# Altium project GateWay.PrjPCB
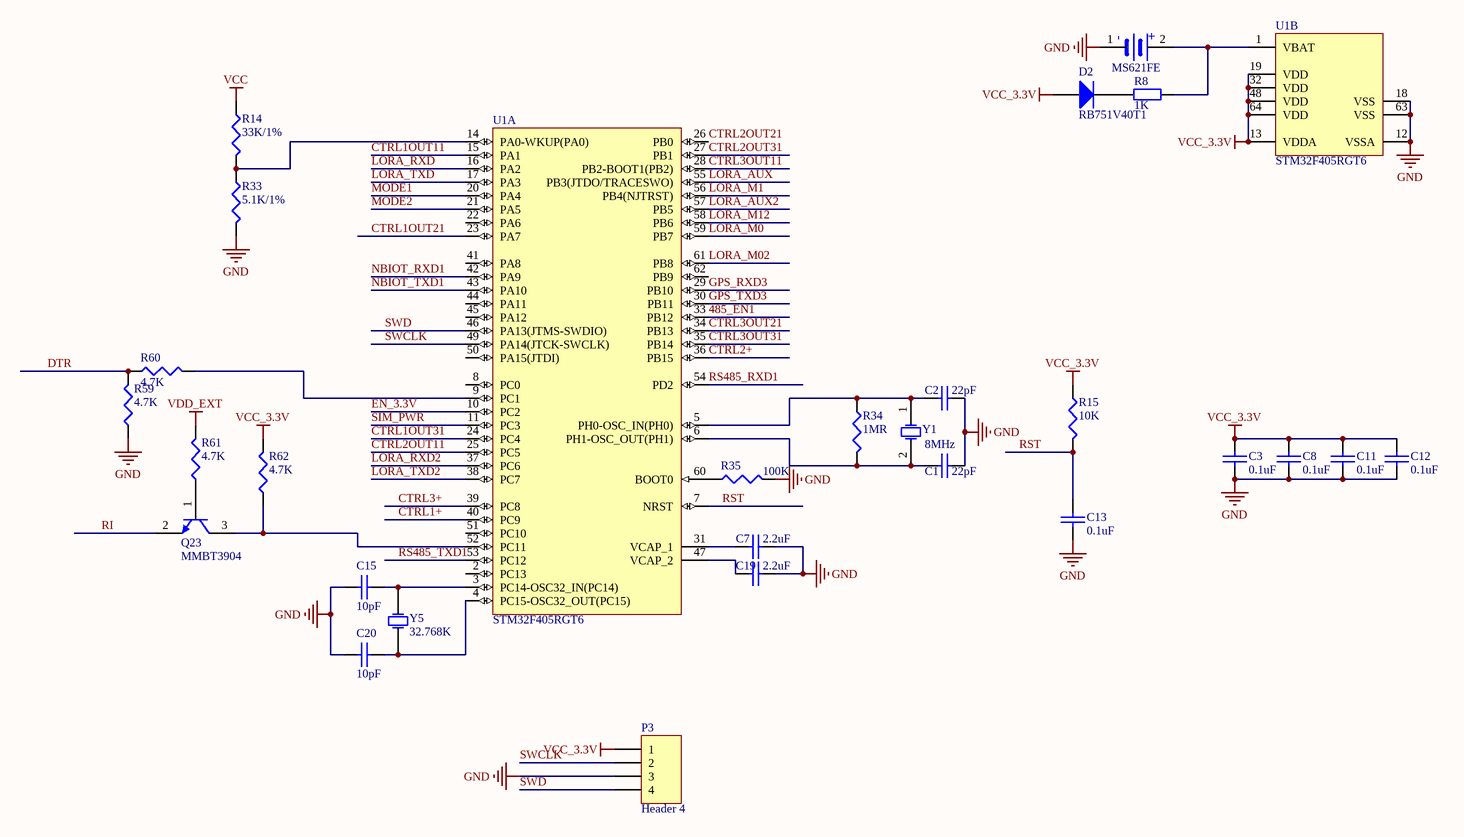
[diagram p0: CPU.SchDoc]
6 sheets, 164 parts. Net scope: global (net labels, ports and power ports of the same name join across sheets).
Board file: GateWay.PcbDoc
Sheets:
  CPU.SchDoc
  LORA.SchDoc
  nbiot&gps.SchDoc
  POWER.SchDoc
  CONNECTOR.SchDoc
  rs485.SchDoc

## Sheet CPU.SchDoc
size A3

### Parts
C1  22pF  [0603c]
C2  22pF  [0603c]
C3  0.1uF  [0603c]
C7  2.2uF  [0603c]
C8  0.1uF  [0603c]
C11  0.1uF  [0603c]
C12  0.1uF  [0603c]
C13  0.1uF  [0603c]
C15  10pF  [0603c]
C19  2.2uF  [0603c]
C20  10pF  [0603c]
D2  RB751V40T1  [SOD323]
MS621FE  SBatery  [MS621FE]  (value not drawn)
P3  Header 4  [HDR1X4]
Q23  MMBT3904  [SOT23-3]
R8  1K  [0603R]
R14  33K/1%  [0603R]
R15  10K  [0603R]
R33  5.1K/1%  [0603R]
R34  1MR  [0603R]
R35  100K  [0603R]
R59  4.7K  [0603R]
R60  4.7K  [0603R]
R61  4.7K  [0603R]
R62  4.7K  [0603R]
U1  STM32F405RGT6  [LQFP-64]  (parts A,B of 2)
Y1  8MHz  [CRAY_5032]
Y5  32.768K  [32.768K]

### Nets
GND: C1.1 C2.1 C3.1 C7.1 C8.1 C11.1 C12.1 C13.1 C15.1 C19.1 C20.1 MS621FE.1 P3.3 R33.2 R35.2 R59.1 U1.12(VSSA) U1.18(VSS) U1.63(VSS)  [project net AGND]
VCC: R14.1
VCC_3.3V: C3.2 C8.2 C11.2 C12.2 D2.1(A) P3.1 R15.1 R62.2 U1.13(VDDA) U1.19(VDD) U1.32(VDD) U1.48(VDD) U1.64(VDD)
VDD_EXT: R61.2
485_EN1: U1.33(PB12)
CTRL1+: U1.40(PC9)
CTRL1OUT11: U1.15(PA1)
CTRL1OUT21: U1.23(PA7)
CTRL1OUT31: U1.24(PC4)
CTRL2+: U1.36(PB15)
CTRL2OUT11: U1.25(PC5)
CTRL2OUT21: U1.26(PB0)
CTRL2OUT31: U1.27(PB1)
CTRL3+: U1.39(PC8)
CTRL3OUT11: U1.28(PB2-BOOT1(PB2))
CTRL3OUT21: U1.34(PB13)
CTRL3OUT31: U1.35(PB14)
DTR: R59.2 R60.1
EN_3.3V: U1.10(PC2)
GPS_RXD3: U1.29(PB10)
GPS_TXD3: U1.30(PB11)
LORA_AUX: U1.55(PB3(JTDO/TRACESWO))
LORA_AUX2: U1.57(PB5)
LORA_M0: U1.59(PB7)
LORA_M1: U1.56(PB4(NJTRST))
LORA_M02: U1.61(PB8)
LORA_M12: U1.58(PB6)
LORA_RXD: U1.16(PA2)
LORA_RXD2: U1.37(PC6)
LORA_TXD: U1.17(PA3)
LORA_TXD2: U1.38(PC7)
MODE1: U1.20(PA4)
MODE2: U1.21(PA5)
NBIOT_RXD1: U1.42(PA9)
NBIOT_TXD1: U1.43(PA10)
RI: Q23.2(E)
RS485_RXD1: U1.54(PD2)
RS485_TXD1: U1.53(PC12)
RST: C13.2 R15.2 U1.7(NRST)
SIM_PWR: U1.11(PC3)
SWCLK: P3.2 U1.49(PA14(JTCK-SWCLK))
SWD: P3.4 U1.46(PA13(JTMS-SWDIO))
NetC1_2: C1.2 R34.2 U1.6(PH1-OSC_OUT(PH1)) Y1.2(OSC2)
NetC2_2: C2.2 R34.1 U1.5(PH0-OSC_IN(PH0)) Y1.1(OSC1)
NetC7_2: C7.2 U1.31(VCAP_1)
NetC15_2: C15.2 U1.3(PC14-OSC32_IN(PC14)) Y5.1(OSC1)
NetC19_2: C19.2 U1.47(VCAP_2)
NetC20_2: C20.2 U1.4(PC15-OSC32_OUT(PC15)) Y5.2(OSC2)
NetD2_2: D2.2(K) R8.1
NetMS621FE_2: MS621FE.2 R8.2 U1.1(VBAT)
NetQ23_1: Q23.1(B) R61.1
NetQ23_3: Q23.3(C) R62.1 U1.52(PC11)
NetR14_2: R14.2 R33.1 U1.14(PA0-WKUP(PA0))
NetR35_1: R35.1 U1.60(BOOT0)
NetR60_2: R60.2 U1.9(PC1)

Not connected (* = marked no-connect by the designer): U1 2(PC13) 8(PC0) 22(PA6) 41(PA8) 44(PA11) 45(PA12) 50(PA15(JTDI)) 51(PC10) 62(PB9)

### Notes on the sheet
- (in symbol SBatery) -; +

### Library data of the parts
C1-C3 C7 C8 C11-C13 C15 C19 C20 = CAP: Capacitor
D2 = Diode: Default Diode; Published: 8-Jun-2000; LatestRevisionDate: 17-Jul-2002; LatestRevisionNote: Re-released for DXP Platform.; PackageDocument: Sep-1996; PackageReference: SMC; Publisher: Altium Limited; Code_JEDEC: DO-214-AB
P3 = Header 4: Header, 4-Pin; LatestRevisionDate: 17-Jul-2002; LatestRevisionNote: Re-released for DXP Platform.; Publisher: Altium Limited
Q23 = NPN
R8 = Res2: Resistor; Published: 8-Jun-2000; LatestRevisionDate: 17-Jul-2002; LatestRevisionNote: Re-released for DXP Platform.; PackageReference: AXIAL-0.4; Publisher: Altium Limited; Value: 1K
R14 R15 R33-R35 = Res3: Resistor; Published: 8-Jun-2000; LatestRevisionDate: 29-May-2009; LatestRevisionNote: IPC-7351 Footprint Added.; PackageReference: J1-0603; Publisher: Altium Limited; PackageDescription: Chip Resistor
R59-R62 = RES1: P: 1/8W
U1 = STM32F405RGT6: ARM Cortex-M4 32-bit MCU+FPU, 210 DMIPS, 1024 kB Flash, 192 kB Internal RAM, 51 I/Os, 64-pin LQFP, -40 to 85 degC, Tray; Manufacturer: STMicroelectronics; D/A Converter: 2x12-bit; FLASH Size (Prog) (kB): 1024; I/Os (High Current): 51; Internal RAM Size (kB): 192; Operating Frequency(F) (Processor speed) (MHz): 168; Supply Voltage(Vcc) max (V): 3.6; Supply Voltage(Vcc) min (V): 1.8; DatasheetVersion: Rev. 4; PackageVersion: Rev. 4, 06/2013; PackageReference: LQFP64; PackageDescription: 64-Pin Low Profile Quad Flat Package, 10 x 10 mm Body, 0.5 mm Pitch; Supplier 1: Digi-Key; Supplier Part Number 1: 497-11767-ND; Supplier 2: Farnell; Supplier Part Number 2: 2064363; Supplier 3: Newark; Supplier Part Number 3: 73T2329; Supplier 4: Mouser; Supplier Part Number 4: 511-STM32F405RGT6; Core: ARM Cortex-M4; Packing: Tray; Mounting Technology: Surface Mount; PartNumber: STM32F405RGT6; ComponentLink1Description: Manufacturer URL; ComponentLink1URL: http://www.st.com/web/en/home.html; ComponentLink2Description: Datasheet; ComponentLink2URL: http://www.st.com/st-web-ui/static/active/en/resource/technical/document/datasheet/DM00037051.pdf; ComponentLink3Description: Package Specification; ComponentLink3URL: http://www.st.com/st-web-ui/static/active/en/resource/technical/document/datasheet/DM00037051.pdf
Y1 Y5 = XTAL: Crystal Oscillator; Published: 8-Jun-2000; LatestRevisionDate: 17-Jul-2002; LatestRevisionNote: Re-released for DXP Platform.; PackageReference: R38; Publisher: Altium Limited
  Y1: PackageDescription: Crystal, Thru-Hole; 2 Leads; Body 3.1 x 8.2 mm (Dia.xH)

## Sheet LORA.SchDoc
size A4
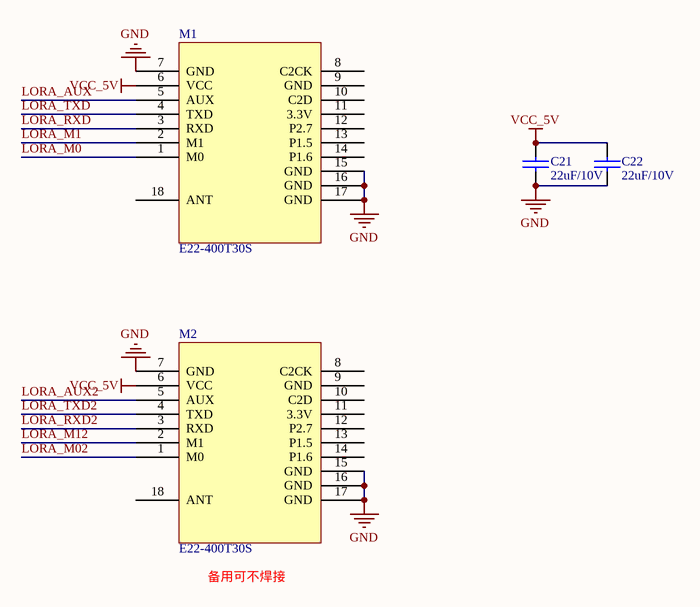
[diagram p1: LORA.SchDoc]

### Parts
C21  22uF/10V  [1206C]
C22  22uF/10V  [1206C]
M1  E22-400T30S  [E22-400T30S]
M2  E22-400T30S  [E22-400T30S]

### Nets
GND: C21.2 C22.2 M1.7(GND) M1.15(GND) M1.16(GND) M1.17(GND) M2.7(GND) M2.15(GND) M2.16(GND) M2.17(GND)  [project net AGND]
VCC_5V: C21.1 C22.1 M1.6(VCC) M2.6(VCC)  [project net VCC5V_OUT]
LORA_AUX: M1.5(AUX)
LORA_AUX2: M2.5(AUX)
LORA_M0: M1.1(M0)
LORA_M1: M1.2(M1)
LORA_M02: M2.1(M0)
LORA_M12: M2.2(M1)
LORA_RXD: M1.3(RXD)
LORA_RXD2: M2.3(RXD)
LORA_TXD: M1.4(TXD)
LORA_TXD2: M2.4(TXD)

Not connected (* = marked no-connect by the designer): M1 8(C2CK) 9(GND) 10(C2D) 11(3.3V) 12(P2.7) 13(P1.5) 14(P1.6) 18(ANT); M2 8(C2CK) 9(GND) 10(C2D) 11(3.3V) 12(P2.7) 13(P1.5) 14(P1.6) 18(ANT)

### Notes on the sheet
- 备用可不焊接

### Library data of the parts
C21 C22 = CAP: Capacitor

## Sheet nbiot&gps.SchDoc
size A3
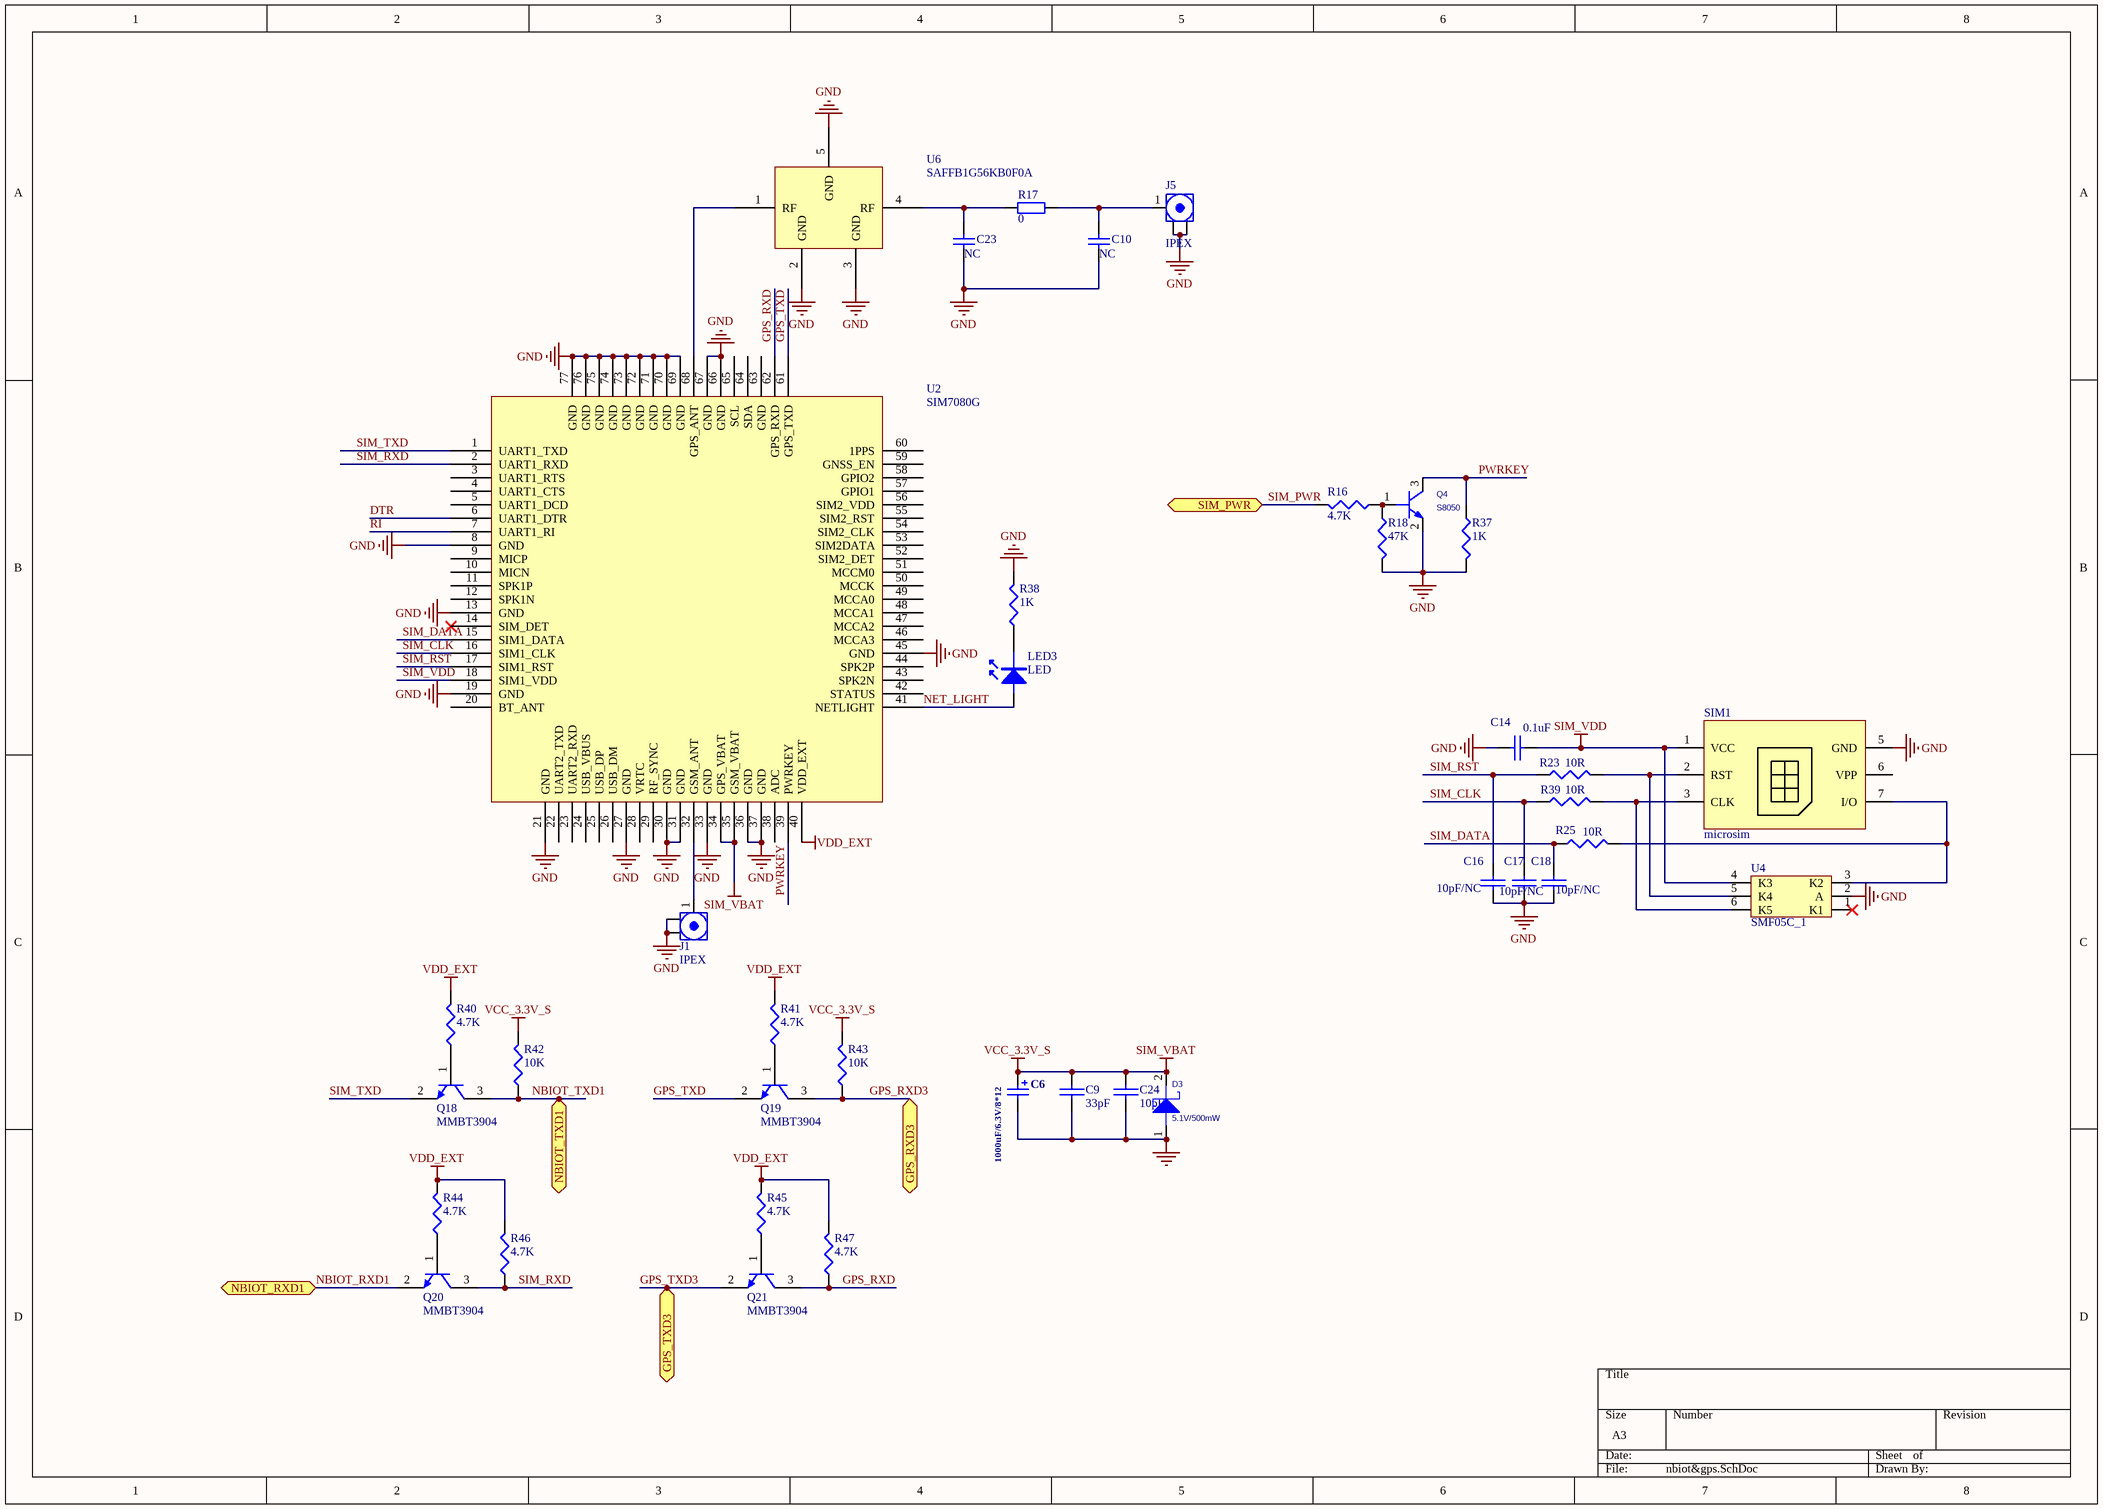
[diagram p2: nbiot&gps.SchDoc]

### Parts
C6  1000uF/6.3V/8*12  [8*12]
C9  33pF  [0603C]
C10  NC  [0603C]
C14  0.1uF  [0603C]
C16  10pF/NC  [0603C]
C17  10pF/NC  [0603C]
C18  10pF/NC  [0603C]
C23  NC  [0603C]
C24  10pF  [0603C]
D3  value 5.1V/500mW  [LL-34(D1206)]  (hidden comment: DIODE_SCHOTTKY_0)
J1  IPEX  [RF-UFL]
J5  IPEX  [RF-UFL]
LED3  LED  [0603LED]
Q4  S8050  [SOT23]
Q18  MMBT3904  [SOT23-3]
Q19  MMBT3904  [SOT23-3]
Q20  MMBT3904  [SOT23-3]
Q21  MMBT3904  [SOT23-3]
R16  4.7K  [0603R]
R17  0  [0603R]
R18  47K  [0603R]
R23  10R  [0603R]
R25  10R  [0603R]
R37  1K  [0603R]
R38  1K  [0603R]
R39  10R  [0603R]
R40  4.7K  [0603R]
R41  4.7K  [0603R]
R42  10K  [0603R]
R43  10K  [0603R]
R44  4.7K  [0603R]
R45  4.7K  [0603R]
R46  4.7K  [0603R]
R47  4.7K  [0603R]
SIM1  microsim  [Nano SIM]
U2  SIM7080G  [SIM868]
U4  SMF05C_1  [SC70-6L]
U6  SAFFB1G56KB0F0A  [SAFFB1G56KB0F0A]

### Ports
GPS_RXD3, GPS_TXD3, NBIOT_RXD1, NBIOT_TXD1, SIM_PWR

### Nets
GND: C6.2 C9.1 C10.2 C14.1 C16.1 C17.1 C18.1 C23.2 C24.1 D3.1 J1.2(Y) J5.2(Y) Q4.2(E) R18.2 R37.2 R38.2 SIM1.5(GND) U2.8(GND) U2.13(GND) U2.19(GND) U2.21(GND) U2.27(GND) U2.30(GND) U2.31(GND) U2.33(GND) U2.36(GND) U2.37(GND) U2.45(GND) U2.66(GND) U2.67(GND) U2.69(GND) U2.70(GND) U2.71(GND) U2.72(GND) U2.73(GND) U2.74(GND) U2.75(GND) U2.76(GND) U2.77(GND) U4.2(A) U6.2(GND) U6.3(GND) U6.5(GND)  [project net AGND]
SIM_VBAT: C6.1 C9.2 C24.2 D3.2 R42.2 R43.2 U2.34(GPS_VBAT) U2.35(GSM_VBAT)  [also labelled VCC_3.3V_S]
SIM_VDD: C14.2 SIM1.1(VCC) U2.18(SIM1_VDD) U4.4(K3)
VDD_EXT: R40.2 R41.2 R44.2 R45.2 R46.2 R47.2 U2.40(VDD_EXT)
DTR: U2.6(UART1_DTR)
GPS_RXD: Q21.3(C) R47.1 U2.62(GPS_RXD)
GPS_RXD3: Q19.3(C) R43.1 ; port GPS_RXD3
GPS_TXD: Q19.2(E) U2.61(GPS_TXD)
GPS_TXD3: Q21.2(E) ; port GPS_TXD3
NBIOT_RXD1: Q20.2(E) ; port NBIOT_RXD1
NBIOT_TXD1: Q18.3(C) R42.1 ; port NBIOT_TXD1
NET_LIGHT: LED3.1 U2.41(NETLIGHT)
PWRKEY: Q4.3(C) R37.1 U2.39(PWRKEY)
RI: U2.7(UART1_RI)
SIM_CLK: C17.2 R39.1 U2.16(SIM1_CLK)
SIM_DATA: C18.2 R25.1 U2.15(SIM1_DATA)
SIM_PWR: R16.2 ; port SIM_PWR
SIM_RST: C16.2 R23.1 U2.17(SIM1_RST)
SIM_RXD: Q20.3(C) R46.1 U2.2(UART1_RXD)
SIM_TXD: Q18.2(E) U2.1(UART1_TXD)
NetC10_1: C10.1 J5.1(X) R17.2
NetC23_1: C23.1 R17.1 U6.4(RF)
NetJ1_1: J1.1(X) U2.32(GSM_ANT)
NetLED3_2: LED3.2 R38.1
NetQ4_1: Q4.1(B) R16.1 R18.1
NetQ18_1: Q18.1(B) R40.1
NetQ19_1: Q19.1(B) R41.1
NetQ20_1: Q20.1(B) R44.1
NetQ21_1: Q21.1(B) R45.1
NetR23_2: R23.2 SIM1.2(RST) U4.5(K4)
NetR25_2: R25.2 SIM1.7(I/O) U4.3(K2)
NetR39_2: R39.2 SIM1.3(CLK) U4.6(K5)
NetU2_68: U2.68(GPS_ANT) U6.1(RF)

Not connected (* = marked no-connect by the designer): SIM1 6(VPP); U2 3(UART1_RTS) 4(UART1_CTS) 5(UART1_DCD) 9(MICP) 10(MICN) 11(SPK1P) 12(SPK1N) 14(SIM_DET)* 20(BT_ANT) 22(UART2_TXD) 23(UART2_RXD) 24(USB_VBUS) 25(USB_DP) 26(USB_DM) 28(VRTC) 29(RF_SYNC) 38(ADC) 42(STATUS) 43(SPK2N) 44(SPK2P) 46(MCCA3) 47(MCCA2) 48(MCCA1) 49(MCCA0) 50(MCCK) 51(MCCM0) 52(SIM2_DET) 53(SIM2DATA) 54(SIM2_CLK) 55(SIM2_RST) 56(SIM2_VDD) 57(GPIO1) 58(GPIO2) 59(GNSS_EN) 60(1PPS) 63(GND) 64(SDA) 65(SCL); U4 1(K1)*

### Library data of the parts
C6 = Cap Pol3: Polarized Capacitor (Surface Mount); PackageReference: C10*10.2
C9 C14 C16-C18 C24 = CAP: Capacitor
C10 C23 = Cap: Capacitor; Value: 0.1uF/10V; Published: 8-Jun-2000; LatestRevisionDate: 17-Jul-2002; LatestRevisionNote: Re-released for DXP Platform.; PackageReference: RAD-0.3; Publisher: Altium Limited
D3 = DIODE_SCHOTTKY_0: PCB DECAL: DO_214AC; Source_Path: E:\AIH\WORK\A\LIBRARY1.OLB
J1 J5 = ANT
Q4 = 2N1069_1: PspiceTemplate: Q^@REFDES %C %B %E
Q18-Q21 = NPN
R16 R18 R23 R25 R37-R47 = RES1: P: 1/8W
R17 = Res2: Resistor; Published: 8-Jun-2000; LatestRevisionDate: 17-Jul-2002; LatestRevisionNote: Re-released for DXP Platform.; PackageReference: AXIAL-0.4; Publisher: Altium Limited; Value: 0
U2 = SIM868E/SIM868
U4 = SMF05C_1: TVS
U6 = SAFFB1G56KBOFA

## Sheet POWER.SchDoc
size A3
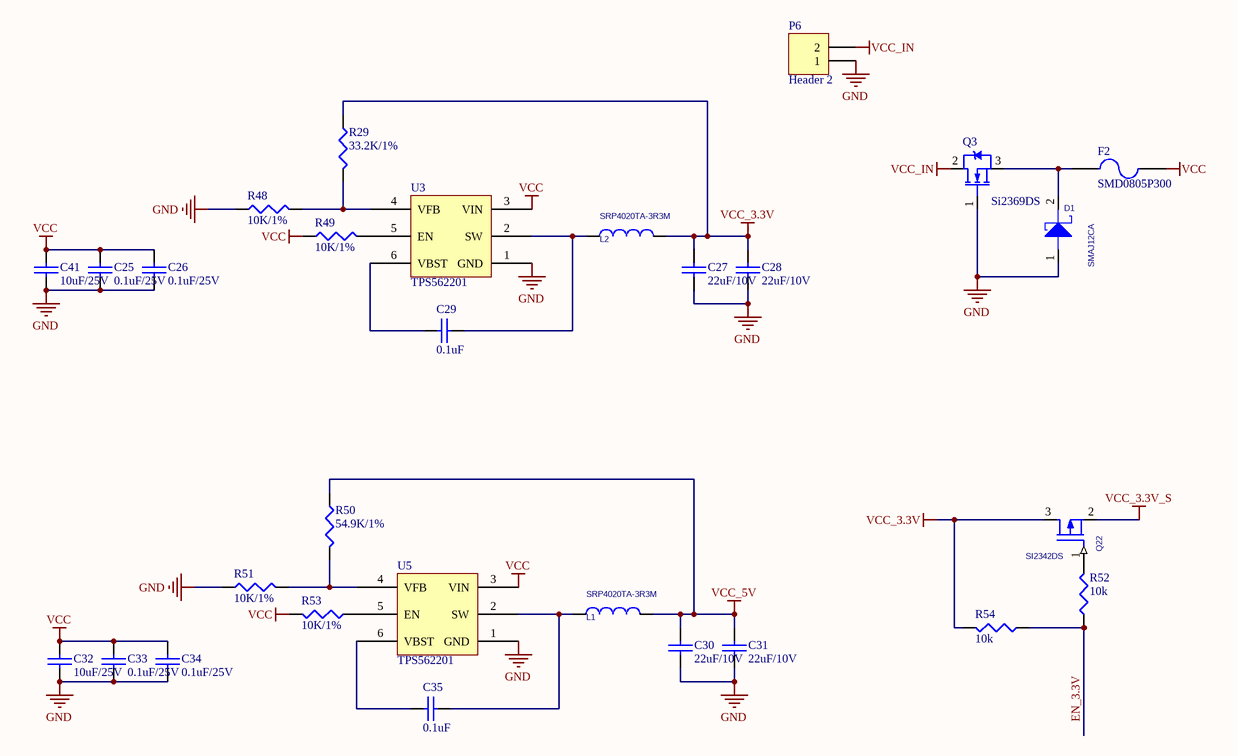
[diagram p3: POWER.SchDoc]

### Parts
C25  0.1uF/25V  [0603C]
C26  0.1uF/25V  [0603C]
C27  22uF/10V  [1206C]
C28  22uF/10V  [1206C]
C29  0.1uF  [0603C]
C30  22uF/10V  [1206C]
C31  22uF/10V  [1206C]
C32  10uF/25V  [0603C]
C33  0.1uF/25V  [0603C]
C34  0.1uF/25V  [0603C]
C35  0.1uF  [0603C]
C41  10uF/25V  [0603C]
D1  SMAJ12CA  [SMA]
F2  SMD0805P300  [0805R]
L1  SRP4020TA-3R3M  [CD_4*4]
L2  SRP4020TA-3R3M  [CD_4*4]
P6  Header 2  [2X2.54MMZ]
Q3  Si2369DS  [sot23-3]
Q22  SI2342DS  [SOT23]
R29  33.2K/1%  [0603R]
R48  10K/1%  [0603R]
R49  10K/1%  [0603R]
R50  54.9K/1%  [0603R]
R51  10K/1%  [0603R]
R52  10k  [0603R]
R53  10K/1%  [0603R]
R54  10k  [0603R]
U3  TPS562201  [SOT-23-6]
U5  TPS562201  [SOT-23-6]

### Nets
GND: C25.1 C26.1 C27.2 C28.2 C30.2 C31.2 C32.1 C33.1 C34.1 C41.1 D1.1 P6.1 Q3.1(G) R48.1 R51.1 U3.1(GND) U5.1(GND)  [project net AGND]
VCC: C25.2 C26.2 C32.2 C33.2 C34.2 C41.2 F2.2 R49.1 R53.2 U3.3(VIN) U5.3(VIN)
VCC_3.3V: C27.1 C28.1 L2.2 Q22.3(SOURCE) R29.1 R54.2
VCC_3.3V_S: Q22.2(DRAIN)  [project net SIM_VBAT]
VCC_5V: C30.1 C31.1 L1.2 R50.1  [project net VCC5V_OUT]
VCC_IN: P6.2 Q3.2(D)
EN_3.3V: R52.1 R54.1
NetC29_1: C29.1 L2.1 U3.2(SW)
NetC29_2: C29.2 U3.6(VBST)
NetC35_1: C35.1 L1.1 U5.2(SW)
NetC35_2: C35.2 U5.6(VBST)
NetD1_2: D1.2 F2.1 Q3.3(S)
NetQ22_1: Q22.1(GATE) R52.2
NetR29_2: R29.2 R48.2 U3.4(VFB)
NetR49_2: R49.2 U3.5(EN)
NetR50_2: R50.2 R51.2 U5.4(VFB)
NetR53_1: R53.1 U5.5(EN)

### Library data of the parts
C25-C35 C41 = CAP: Capacitor
D1 = DIODE_SCHOTTKY_0: as D3 on sheet nbiot&gps; Value: SMAJ12CA
F2 = Fuse 2: Fuse; Published: 8-Jun-2000; LatestRevisionDate: 17-Jul-2002; LatestRevisionNote: Re-released for DXP Platform.; PackageReference: PIN-W2/E2.8; Publisher: Altium Limited
L1 L2 = INDUCTOR_1
P6 = Header 2: Header, 2-Pin; LatestRevisionDate: 17-Jul-2002; LatestRevisionNote: Re-released for DXP Platform.; Publisher: Altium Limited
Q3 = NCE4060K: NMOSFET
Q22 = MOSFET P_1: Color: RGB(255,  0,  0)
R29 R48-R54 = RES1: P: 1/8W

## Sheet CONNECTOR.SchDoc
size A3
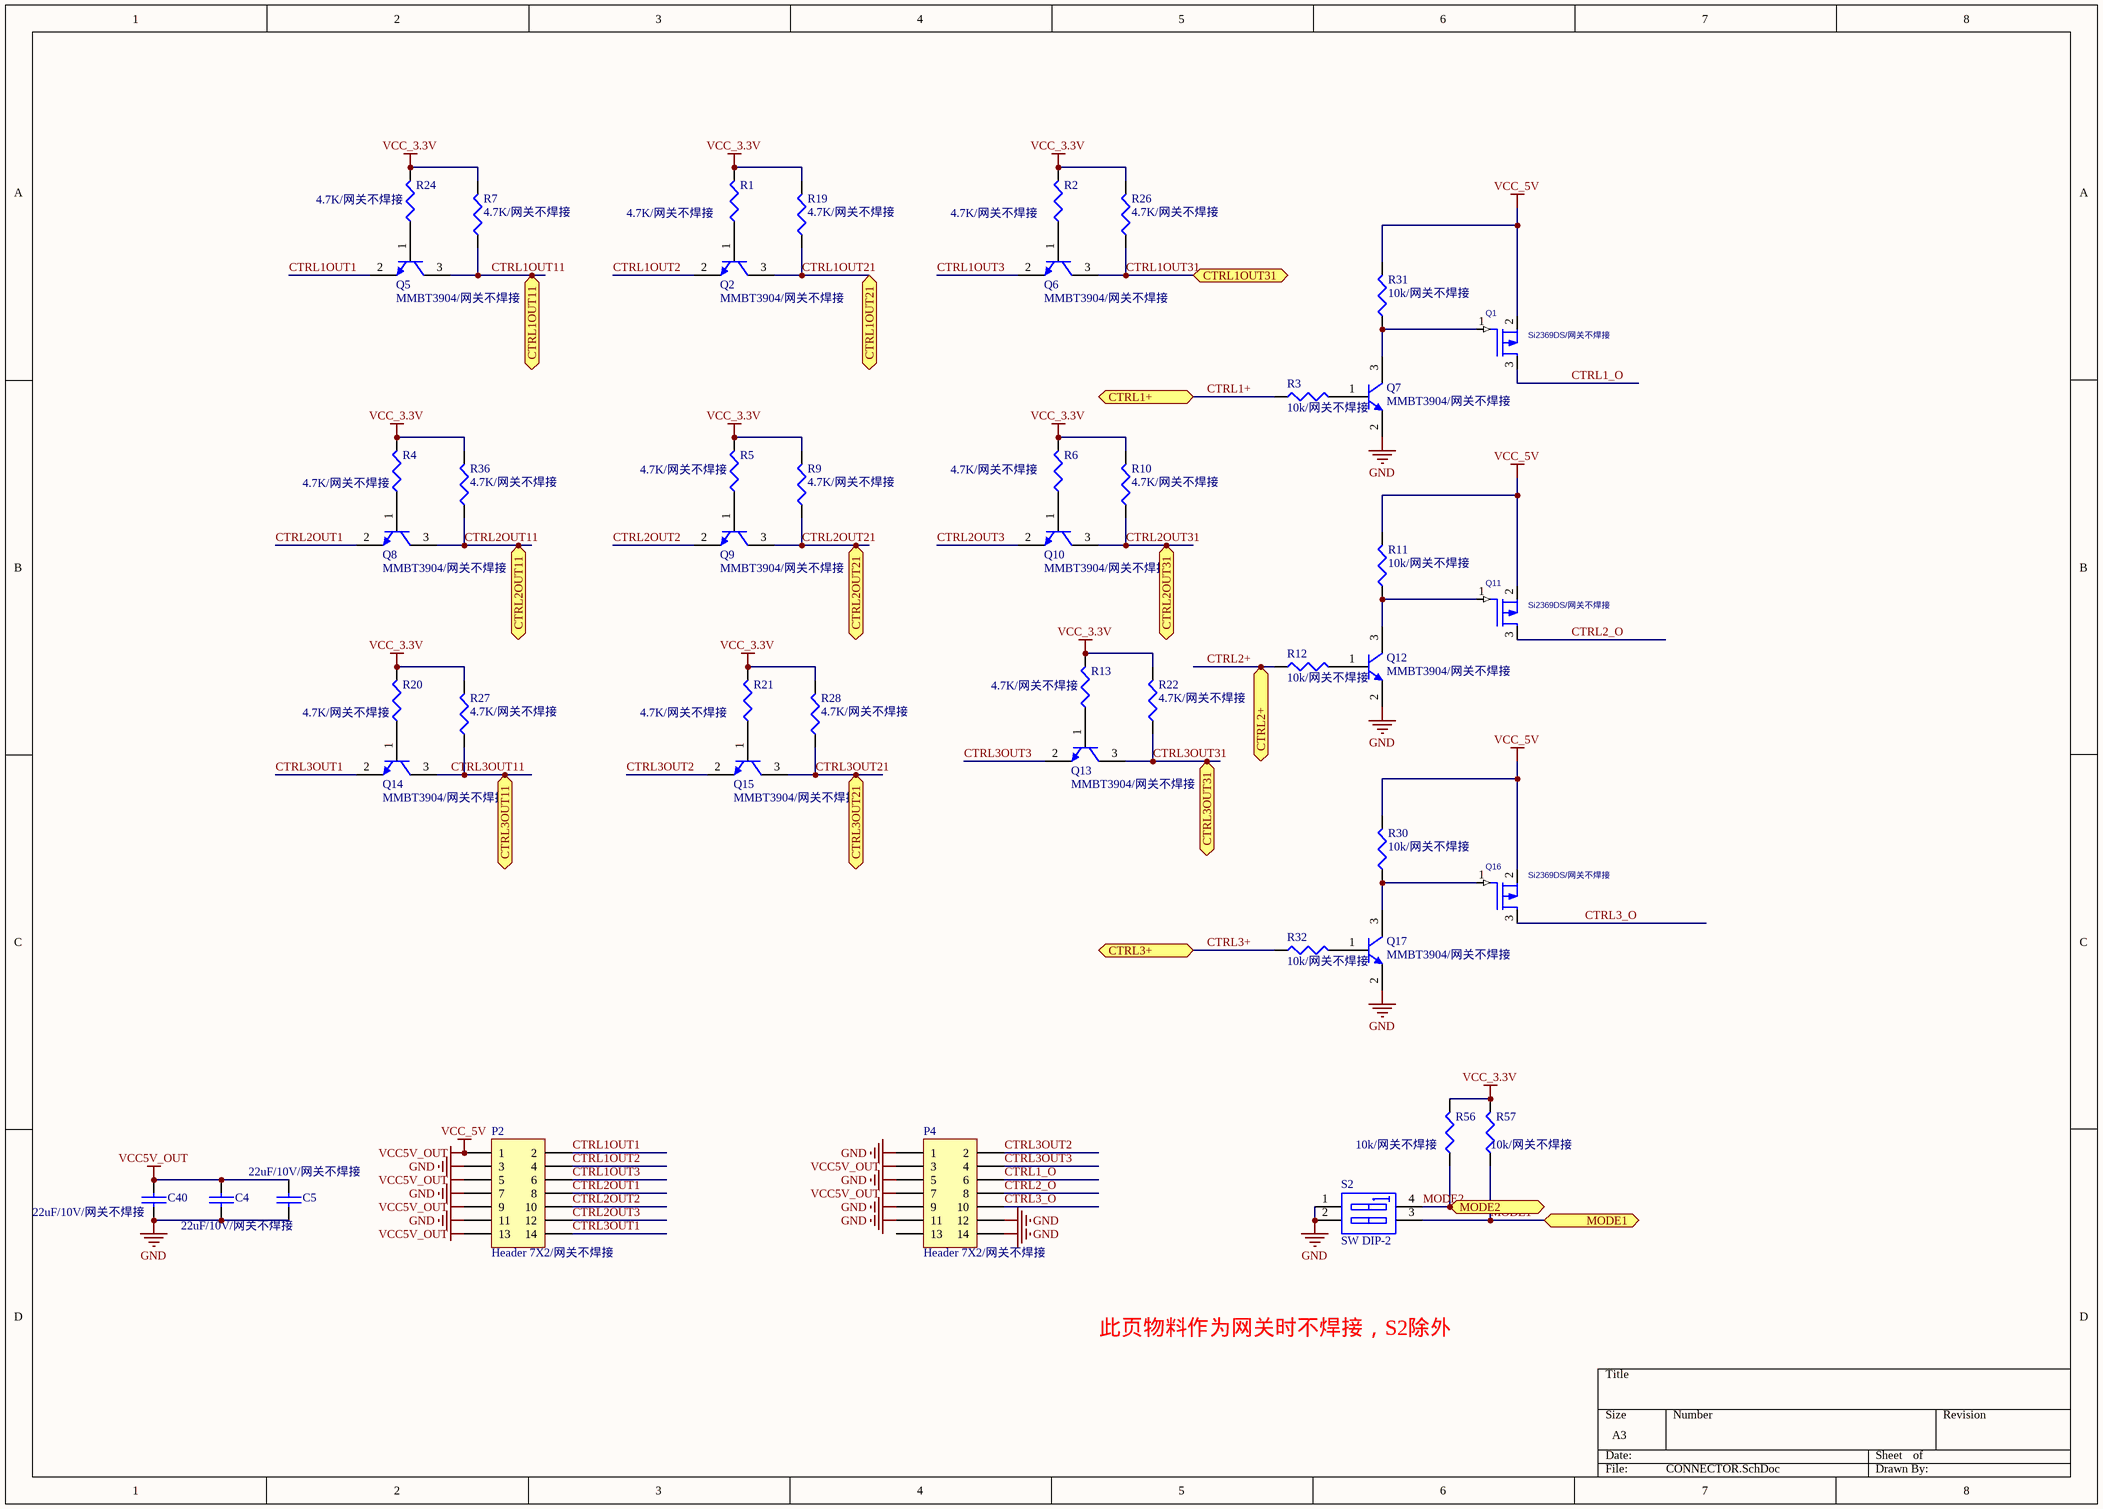
[diagram p4: CONNECTOR.SchDoc]

### Parts
C4  22uF/10V/网关不焊接  [1206C]
C5  22uF/10V/网关不焊接  [1206C]
C40  22uF/10V/网关不焊接  [1206C]
P2  Header 7X2/网关不焊接  [14X2.54MMZ]
P4  Header 7X2/网关不焊接  [14X2.54MMZ]
Q1  Si2369DS/网关不焊接  [SOT23]
Q2  MMBT3904/网关不焊接  [SOT23-3]
Q5  MMBT3904/网关不焊接  [SOT23-3]
Q6  MMBT3904/网关不焊接  [SOT23-3]
Q7  MMBT3904/网关不焊接  [SOT23-3]
Q8  MMBT3904/网关不焊接  [SOT23-3]
Q9  MMBT3904/网关不焊接  [SOT23-3]
Q10  MMBT3904/网关不焊接  [SOT23-3]
Q11  Si2369DS/网关不焊接  [SOT23]
Q12  MMBT3904/网关不焊接  [SOT23-3]
Q13  MMBT3904/网关不焊接  [SOT23-3]
Q14  MMBT3904/网关不焊接  [SOT23-3]
Q15  MMBT3904/网关不焊接  [SOT23-3]
Q16  Si2369DS/网关不焊接  [SOT23]
Q17  MMBT3904/网关不焊接  [SOT23-3]
R1  4.7K/网关不焊接  [0603R]
R2  4.7K/网关不焊接  [0603R]
R3  10k/网关不焊接  [0603R]
R4  4.7K/网关不焊接  [0603R]
R5  4.7K/网关不焊接  [0603R]
R6  4.7K/网关不焊接  [0603R]
R7  4.7K/网关不焊接  [0603R]
R9  4.7K/网关不焊接  [0603R]
R10  4.7K/网关不焊接  [0603R]
R11  10k/网关不焊接  [0603R]
R12  10k/网关不焊接  [0603R]
R13  4.7K/网关不焊接  [0603R]
R19  4.7K/网关不焊接  [0603R]
R20  4.7K/网关不焊接  [0603R]
R21  4.7K/网关不焊接  [0603R]
R22  4.7K/网关不焊接  [0603R]
R24  4.7K/网关不焊接  [0603R]
R26  4.7K/网关不焊接  [0603R]
R27  4.7K/网关不焊接  [0603R]
R28  4.7K/网关不焊接  [0603R]
R30  10k/网关不焊接  [0603R]
R31  10k/网关不焊接  [0603R]
R32  10k/网关不焊接  [0603R]
R36  4.7K/网关不焊接  [0603R]
R56  10k/网关不焊接  [0603R]
R57  10k/网关不焊接  [0603R]
S2  SW DIP-2  [SW_SMT_4]

### Ports
CTRL1+, CTRL1OUT11, CTRL1OUT21, CTRL1OUT31, CTRL2+, CTRL2OUT11, CTRL2OUT21, CTRL2OUT31, CTRL3+, CTRL3OUT11, CTRL3OUT21, CTRL3OUT31, MODE1, MODE2

### Nets
GND: C4.2 C5.2 C40.2 P2.3 P2.7 P2.11 P4.1 P4.5 P4.9 P4.11 P4.12 P4.14 Q7.2(E) Q12.2(E) Q17.2(E) S2.1(A1) S2.2(A2)  [project net AGND]
VCC5V_OUT: C4.1 C5.1 C40.1 P2.1 P2.5 P2.9 P2.13 P4.3 P4.7 Q1.2(DRAIN) Q11.2(DRAIN) Q16.2(DRAIN) R11.2 R30.2 R31.2  [also labelled VCC_5V]
VCC_3.3V: R1.2 R2.2 R4.2 R5.2 R6.2 R7.2 R9.2 R10.2 R13.2 R19.2 R20.2 R21.2 R22.2 R24.2 R26.2 R27.2 R28.2 R36.2 R56.2 R57.2
CTRL1+: R3.1 ; port CTRL1+
CTRL1_O: P4.6 Q1.3(SOURCE)
CTRL1OUT1: P2.2 Q5.2(E)
CTRL1OUT2: P2.4 Q2.2(E)
CTRL1OUT3: P2.6 Q6.2(E)
CTRL1OUT11: Q5.3(C) R7.1 ; port CTRL1OUT11
CTRL1OUT21: Q2.3(C) R19.1 ; port CTRL1OUT21
CTRL1OUT31: Q6.3(C) R26.1 ; port CTRL1OUT31
CTRL2+: R12.1 ; port CTRL2+
CTRL2_O: P4.8 Q11.3(SOURCE)
CTRL2OUT1: P2.8 Q8.2(E)
CTRL2OUT2: P2.10 Q9.2(E)
CTRL2OUT3: P2.12 Q10.2(E)
CTRL2OUT11: Q8.3(C) R36.1 ; port CTRL2OUT11
CTRL2OUT21: Q9.3(C) R9.1 ; port CTRL2OUT21
CTRL2OUT31: Q10.3(C) R10.1 ; port CTRL2OUT31
CTRL3+: R32.1 ; port CTRL3+
CTRL3_O: P4.10 Q16.3(SOURCE)
CTRL3OUT1: P2.14 Q14.2(E)
CTRL3OUT2: P4.2 Q15.2(E)
CTRL3OUT3: P4.4 Q13.2(E)
CTRL3OUT11: Q14.3(C) R27.1 ; port CTRL3OUT11
CTRL3OUT21: Q15.3(C) R28.1 ; port CTRL3OUT21
CTRL3OUT31: Q13.3(C) R22.1 ; port CTRL3OUT31
MODE1: R57.1 S2.3(B2) ; port MODE1
MODE2: R56.1 S2.4(B1) ; port MODE2
NetQ1_1: Q1.1(GATE) Q7.3(C) R31.1
NetQ2_1: Q2.1(B) R1.1
NetQ5_1: Q5.1(B) R24.1
NetQ6_1: Q6.1(B) R2.1
NetQ7_1: Q7.1(B) R3.2
NetQ8_1: Q8.1(B) R4.1
NetQ9_1: Q9.1(B) R5.1
NetQ10_1: Q10.1(B) R6.1
NetQ11_1: Q11.1(GATE) Q12.3(C) R11.1
NetQ12_1: Q12.1(B) R12.2
NetQ13_1: Q13.1(B) R13.1
NetQ14_1: Q14.1(B) R20.1
NetQ15_1: Q15.1(B) R21.1
NetQ16_1: Q16.1(GATE) Q17.3(C) R30.1
NetQ17_1: Q17.1(B) R32.2

Not connected (* = marked no-connect by the designer): P4 13

### Notes on the sheet
- 此页物料作为网关时不焊接，S2除外

### Library data of the parts
C4 C5 C40 = CAP: Capacitor
P2 P4 = Header 7X2: Header, 7-Pin, Dual row; LatestRevisionDate: 17-Jul-2002; LatestRevisionNote: Re-released for DXP Platform.; Publisher: Altium Limited
Q1 Q11 Q16 = MOSFET P_1: Color: RGB(255,  0,  0)
Q2 Q5-Q10 Q12-Q15 Q17 = NPN
R1-R7 R9-R13 R19-R22 R24 R26-R28 R30-R32 R36 R56 R57 = RES1: P: 1/8W
S2 = SW DIP-2: DIP Switch, 2 Position, SPST; Published: 24-Mar-1999; LatestRevisionDate: 17-Jul-2002; LatestRevisionNote: Re-released for DXP Platform.; PackageReference: DIP-4; Publisher: Altium Limited

## Sheet rs485.SchDoc
size A4
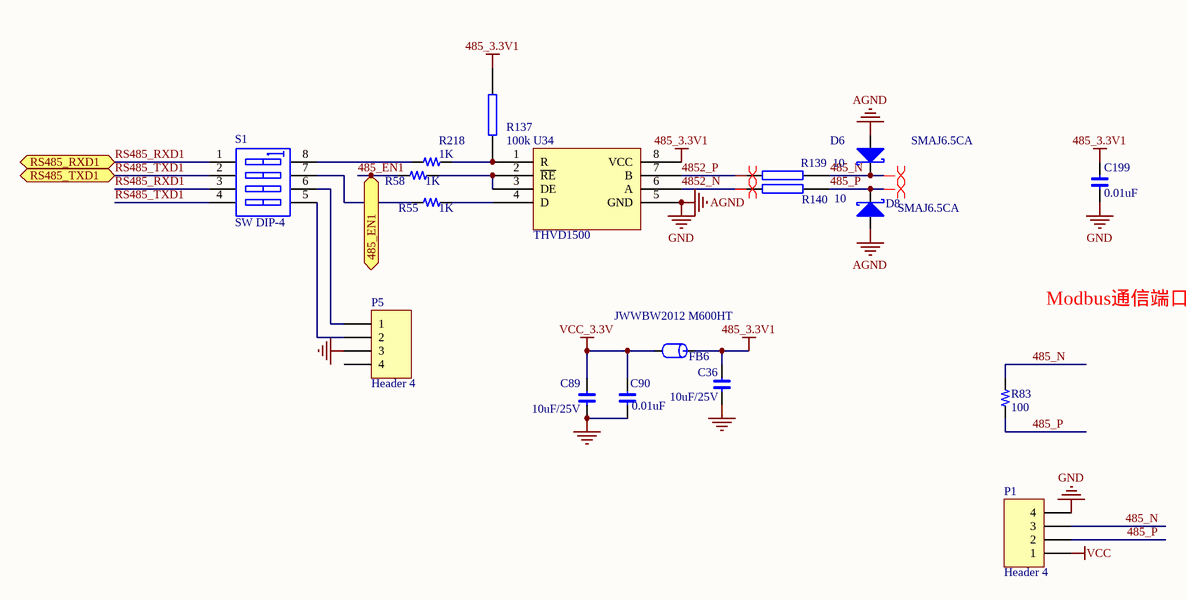
[diagram p5: rs485.SchDoc]

### Parts
C36  10uF/25V  [0603C]
C89  10uF/25V  [0603C]
C90  0.01uF  [0603C]
C199  0.01uF  [0603C]
D6  SMAJ6.5CA  [SMA]
D8  SMAJ6.5CA  [SMA]
FB6  JWWBW2012 M600HT  [0805CZ]
P1  Header 4  [4X2.54MMZ]
P5  Header 4  [4X2.54MMZ]
R55  1K  [0603R]
R58  1K  [0603R]
R83  100  [0603R]
R137  100k  [0603R]
R139  10  [1206R]
R140  10  [1206R]
R218  1K  [0603R]
S1  SW DIP-4  [SW_SMT_8]
U34  THVD1500  [so-8]

### Ports
485_EN1, RS485_RXD1, RS485_TXD1

### Nets
485_3.3V1: C36.2 C199.2 FB6.1 R137.2 U34.8(VCC)
AGND: C36.1 C89.1 C90.1 C199.1 D6.1(A) D8.1(A) P1.4 P5.3 U34.5(GND)  [also labelled GND]
VCC: P1.1
VCC_3.3V: C89.2 C90.2 FB6.2
485_EN1: R58.2 ; port 485_EN1
485_N: D6.2(K) P1.3 R83.2 R139.1
485_P: D8.2(K) P1.2 R83.1 R140.1
4852_N: R140.2 U34.6(A)
4852_P: R139.2 U34.7(B)
RS485_RXD1: S1.1(A1) S1.3(A3) ; port RS485_RXD1
RS485_TXD1: S1.2(A2) S1.4(A4) ; port RS485_TXD1
NetP5_1: P5.1 S1.6(B3)
NetP5_2: P5.2 S1.5(B4)
NetR55_1: R55.1 U34.4(D)
NetR55_2: R55.2 S1.7(B2)
NetR58_1: R58.1 U34.2(~{RE}) U34.3(DE)
NetR137_1: R137.1 R218.1 U34.1(R)
NetR218_2: R218.2 S1.8(B1)

Not connected (* = marked no-connect by the designer): P5 4

### Layout directives
differential pair: 485_N, 485_P, 4852_N, 4852_P

### Notes on the sheet
- Modbus通信端口

### Library data of the parts
C36 C89 C90 C199 = C
D6 D8 = DIODE S: Schottky Diode
FB6 = FB: Part Field 1: 磁珠/0603/1K ohm/100MHz; FB: BLM18BD102SN1(muRata); Text Field1: FB
P1 P5 = Header 4: Header, 4-Pin; LatestRevisionDate: 17-Jul-2002; LatestRevisionNote: Re-released for DXP Platform.; Publisher: Altium Limited
R55 R58 R83 R218 = R
R137 R139 R140 = RES2
S1 = SW DIP-4: DIP Switch, 4 Position, SPST; Published: 24-Mar-1999; LatestRevisionDate: 29-May-2009; LatestRevisionNote: IPC-7351 Footprint Added.; PackageVersion: Dec-2002; PackageReference: SO8; Publisher: Altium Limited; PackageDescription: 8-Pin Small Outline Integrated Circuit 1.27 mm Pitch; Code_JEDEC: MS-012-AA; Code_IPC: SOIC127P600-8
U34 = SN65HVD06D

## Nets that join several sheets
AGND: CPU (19 pins), LORA (10 pins), nbiot&gps (43 pins), POWER (17 pins), CONNECTOR (17 pins), rs485 (9 pins)
SIM_VBAT: nbiot&gps (8 pins), POWER (Q22.2)
VCC: CPU (R14.1), POWER (11 pins), rs485 (P1.1)
VCC5V_OUT: LORA (C21.1 C22.1 M1.6 M2.6), POWER (C30.1 C31.1 L1.2 R50.1), CONNECTOR (15 pins)
VCC_3.3V: CPU (13 pins), POWER (6 pins), CONNECTOR (20 pins), rs485 (C89.2 C90.2 FB6.2)
VDD_EXT: CPU (R61.2), nbiot&gps (7 pins)
485_EN1: CPU (U1.33), rs485 (R58.2)
CTRL1+: CPU (U1.40), CONNECTOR (R3.1)
CTRL1OUT11: CPU (U1.15), CONNECTOR (Q5.3 R7.1)
CTRL1OUT21: CPU (U1.23), CONNECTOR (Q2.3 R19.1)
CTRL1OUT31: CPU (U1.24), CONNECTOR (Q6.3 R26.1)
CTRL2+: CPU (U1.36), CONNECTOR (R12.1)
CTRL2OUT11: CPU (U1.25), CONNECTOR (Q8.3 R36.1)
CTRL2OUT21: CPU (U1.26), CONNECTOR (Q9.3 R9.1)
CTRL2OUT31: CPU (U1.27), CONNECTOR (Q10.3 R10.1)
CTRL3+: CPU (U1.39), CONNECTOR (R32.1)
CTRL3OUT11: CPU (U1.28), CONNECTOR (Q14.3 R27.1)
CTRL3OUT21: CPU (U1.34), CONNECTOR (Q15.3 R28.1)
CTRL3OUT31: CPU (U1.35), CONNECTOR (Q13.3 R22.1)
DTR: CPU (R59.2 R60.1), nbiot&gps (U2.6)
EN_3.3V: CPU (U1.10), POWER (R52.1 R54.1)
GPS_RXD3: CPU (U1.29), nbiot&gps (Q19.3 R43.1)
GPS_TXD3: CPU (U1.30), nbiot&gps (Q21.2)
LORA_AUX: CPU (U1.55), LORA (M1.5)
LORA_AUX2: CPU (U1.57), LORA (M2.5)
LORA_M0: CPU (U1.59), LORA (M1.1)
LORA_M1: CPU (U1.56), LORA (M1.2)
LORA_M02: CPU (U1.61), LORA (M2.1)
LORA_M12: CPU (U1.58), LORA (M2.2)
LORA_RXD: CPU (U1.16), LORA (M1.3)
LORA_RXD2: CPU (U1.37), LORA (M2.3)
LORA_TXD: CPU (U1.17), LORA (M1.4)
LORA_TXD2: CPU (U1.38), LORA (M2.4)
MODE1: CPU (U1.20), CONNECTOR (R57.1 S2.3)
MODE2: CPU (U1.21), CONNECTOR (R56.1 S2.4)
NBIOT_RXD1: CPU (U1.42), nbiot&gps (Q20.2)
NBIOT_TXD1: CPU (U1.43), nbiot&gps (Q18.3 R42.1)
RI: CPU (Q23.2), nbiot&gps (U2.7)
RS485_RXD1: CPU (U1.54), rs485 (S1.1 S1.3)
RS485_TXD1: CPU (U1.53), rs485 (S1.2 S1.4)
SIM_PWR: CPU (U1.11), nbiot&gps (R16.2)